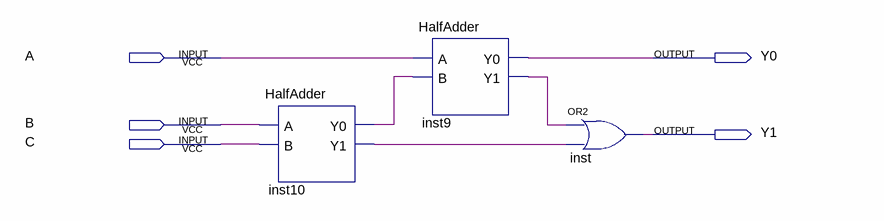
[diagram p0: schematic sheet]
// Quartus schematic 3inAdder.bdf as structural Verilog: 3 symbols, 5 pins
module \3inAdder  (
  input  A,
  input  B,
  input  C,
  output Y0,
  output Y1
);

  wire inst9_y1, inst10_y0, inst10_y1;

  HalfAdder inst10 (.A(B), .B(C), .Y0(inst10_y0), .Y1(inst10_y1));
  HalfAdder inst9 (.A(A), .B(inst10_y0), .Y0(Y0), .Y1(inst9_y1));
  or inst (Y1, inst9_y1, inst10_y1);
endmodule
